# EAGLE design psu_board (EAGLE 9.3.0)
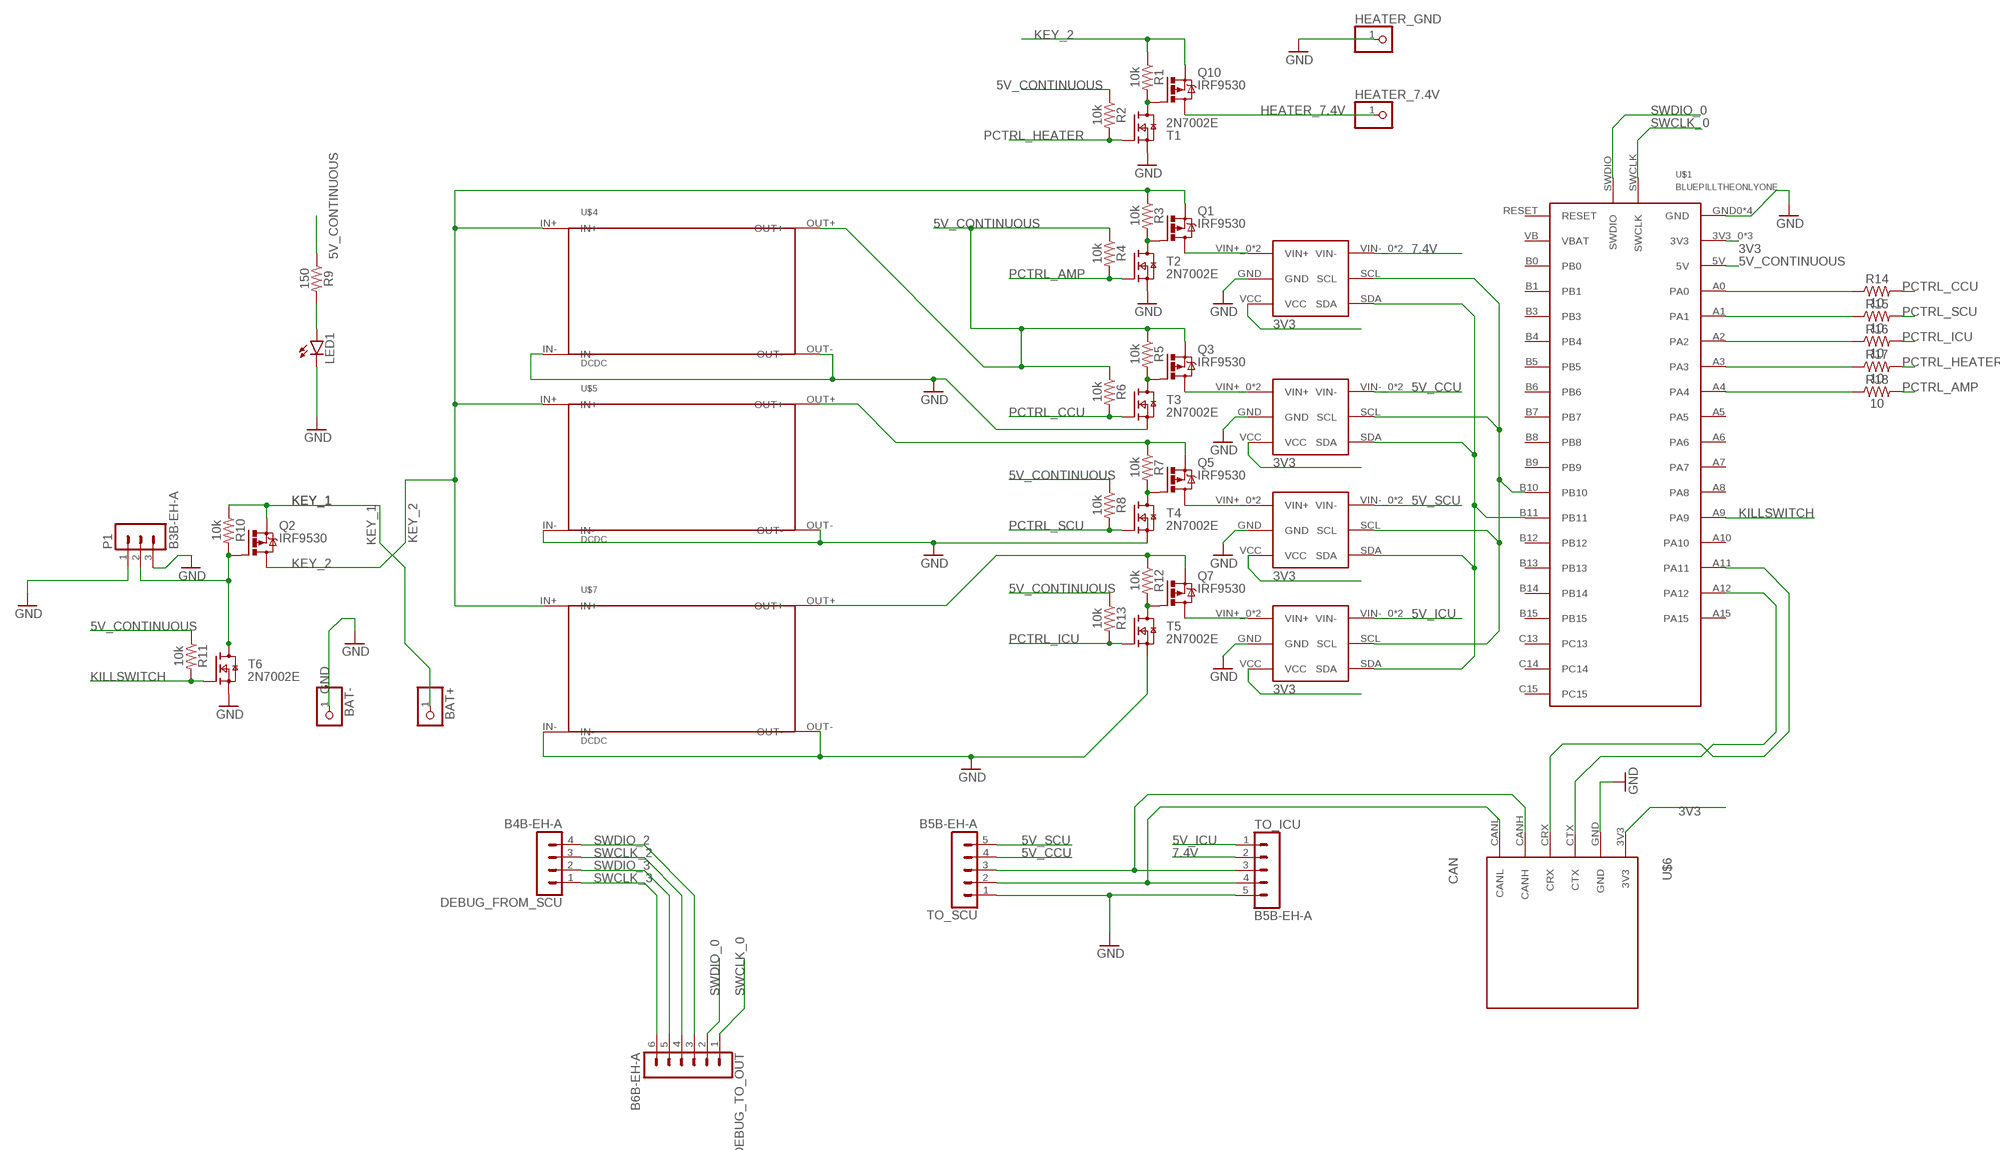
[diagram p0: schematic, sheet 1]

## Parts
BAT+  PINHD-1X1  [1X01]
BAT-  PINHD-1X1  [1X01]
DEBUG_FROM_SCU  B4B-EH-A  [B4B-EH-A]
DEBUG_TO_OUT  B6B-EH-A  [B6B-EH-A]
HEATER_7.4V  PINHD-1X1  [1X01]
HEATER_GND  PINHD-1X1  [1X01]
LED1  LED5MM  [LED5MM]
P1  B3B-EH-A  [B3B-EH-A]
Q1  IRF9530  [TO220BV]
Q2  IRF9530  [TO220BV]
Q3  IRF9530  [TO220BV]
Q5  IRF9530  [TO220BV]
Q7  IRF9530  [TO220BV]
Q10  IRF9530  [TO220BV]
R1  10k  RESISTORAXIAL-0.3  [AXIAL-0.3]
R2  10k  RESISTORAXIAL-0.3  [AXIAL-0.3]
R3  10k  RESISTORAXIAL-0.3  [AXIAL-0.3]
R4  10k  RESISTORAXIAL-0.3  [AXIAL-0.3]
R5  10k  RESISTORAXIAL-0.3  [AXIAL-0.3]
R6  10k  RESISTORAXIAL-0.3  [AXIAL-0.3]
R7  10k  RESISTORAXIAL-0.3  [AXIAL-0.3]
R8  10k  RESISTORAXIAL-0.3  [AXIAL-0.3]
R9  150  RESISTORAXIAL-0.3  [AXIAL-0.3]
R10  10k  RESISTORAXIAL-0.3  [AXIAL-0.3]
R11  10k  RESISTORAXIAL-0.3  [AXIAL-0.3]
R12  10k  RESISTORAXIAL-0.3  [AXIAL-0.3]
R13  10k  RESISTORAXIAL-0.3  [AXIAL-0.3]
R14  10  RESISTORAXIAL-0.3  [AXIAL-0.3]
R15  10  RESISTORAXIAL-0.3  [AXIAL-0.3]
R16  10  RESISTORAXIAL-0.3  [AXIAL-0.3]
R17  10  RESISTORAXIAL-0.3  [AXIAL-0.3]
R18  10  RESISTORAXIAL-0.3  [AXIAL-0.3]
T1  2N7002E  [SOT23]
T2  2N7002E  [SOT23]
T3  2N7002E  [SOT23]
T4  2N7002E  [SOT23]
T5  2N7002E  [SOT23]
T6  2N7002E  [SOT23]
TO_ICU  B5B-EH-A  [B5B-EH-A]
TO_SCU  B5B-EH-A  [B5B-EH-A]
U$1  BLUEPILLTHEONLYONE  [BLUEPIL]
U$2  INA  [INA]
U$3  INA  [INA]
U$4  DCDC  [DCDC]
U$5  DCDC  [DCDC]
U$6  CAN  [CAN]
U$7  DCDC  [DCDC]
U$8  INA  [INA]
U$9  INA  [INA]

## Nets
3V3: U$1.3V3_0(3V3) U$1.3V3_1(3V3) U$1.3V3_2(3V3) U$2.VCC U$3.VCC U$6.3V3 U$8.VCC U$9.VCC
5V_CCU: TO_SCU.4 U$9.VIN-_0(VIN-) U$9.VIN-_1(VIN-)
5V_CONTINUOUS: Q3.S R2.P$1 R4.P$1 R5.P$1 R6.P$1 R8.P$1 R9.P$1 R11.P$1 R13.P$1 U$1.5V U$4.OUT+
5V_ICU: TO_ICU.1 U$2.VIN-_0(VIN-) U$2.VIN-_1(VIN-)
5V_SCU: TO_SCU.5 U$8.VIN-_0(VIN-) U$8.VIN-_1(VIN-)
7.4V: TO_ICU.2 U$3.VIN-_0(VIN-) U$3.VIN-_1(VIN-)
CANH: TO_ICU.3 TO_SCU.3 U$6.CANH
CANL: TO_ICU.4 TO_SCU.2 U$6.CANL
GND: BAT-.1 HEATER_GND.1 LED1.K(C) P1.1 P1.3 T1.2(S) T2.2(S) T3.2(S) T4.2(S) T5.2(S) T6.2(S) TO_ICU.5 TO_SCU.1 U$1.GND0(GND) U$1.GND1(GND) U$1.GND2(GND) U$1.GND3(GND) U$2.GND U$3.GND U$4.IN- U$4.OUT- U$5.IN- U$5.OUT- U$6.GND U$7.IN- U$7.OUT- U$8.GND U$9.GND
HEATER_7.4V: HEATER_7.4V.1 Q10.D
KEY_1: BAT+.1 Q2.S R10.P$1
KEY_2: Q1.S Q2.D Q10.S R1.P$1 R3.P$1 U$4.IN+ U$5.IN+ U$7.IN+
KILLSWITCH: R11.P$2 T6.1(G) U$1.A9
N$1: Q1.G R3.P$2 T2.3(D)
N$2: U$1.A11 U$6.CRX
N$3: Q5.G R7.P$2 T4.3(D)
N$4: Q7.G R12.P$2 T5.3(D)
N$5: Q5.S R7.P$1 U$5.OUT+
N$6: Q3.G R5.P$2 T3.3(D)
N$7: Q7.S R12.P$1 U$7.OUT+
N$8: Q1.D U$3.VIN+_0(VIN+) U$3.VIN+_1(VIN+)
N$9: Q3.D U$9.VIN+_0(VIN+) U$9.VIN+_1(VIN+)
N$10: Q5.D U$8.VIN+_0(VIN+) U$8.VIN+_1(VIN+)
N$11: Q7.D U$2.VIN+_0(VIN+) U$2.VIN+_1(VIN+)
N$12: U$1.B11 U$2.SDA U$3.SDA U$8.SDA U$9.SDA
N$13: U$1.B10 U$2.SCL U$3.SCL U$8.SCL U$9.SCL
N$14: U$1.A12 U$6.CTX
N$15: LED1.A R9.P$2
N$16: Q10.G R1.P$2 T1.3(D)
N$17: R14.P$1 U$1.A0
N$18: R15.P$1 U$1.A1
N$19: R16.P$1 U$1.A2
N$20: R17.P$1 U$1.A3
N$21: R18.P$1 U$1.A4
N$22: P1.2 Q2.G R10.P$2 T6.3(D)
PCTRL_AMP: R4.P$2 R18.P$2 T2.1(G)
PCTRL_CCU: R6.P$2 R14.P$2 T3.1(G)
PCTRL_HEATER: R2.P$2 R17.P$2 T1.1(G)
PCTRL_ICU: R13.P$2 R16.P$2 T5.1(G)
PCTRL_SCU: R8.P$2 R15.P$2 T4.1(G)
SWCLK_0: DEBUG_TO_OUT.1 U$1.SWCLK
SWCLK_2: DEBUG_FROM_SCU.3 DEBUG_TO_OUT.4
SWCLK_3: DEBUG_FROM_SCU.1 DEBUG_TO_OUT.6
SWDIO_0: DEBUG_TO_OUT.2 U$1.SWDIO
SWDIO_2: DEBUG_FROM_SCU.4 DEBUG_TO_OUT.3
SWDIO_3: DEBUG_FROM_SCU.2 DEBUG_TO_OUT.5
Unconnected: U$1.A5 U$1.A6 U$1.A7 U$1.A8 U$1.A10 U$1.A15 U$1.B0 U$1.B1 U$1.B3 U$1.B4 U$1.B5 U$1.B6 U$1.B7 U$1.B8 U$1.B9 U$1.B12 U$1.B13 U$1.B14 U$1.B15 U$1.C13 U$1.C14 U$1.C15 U$1.RESET U$1.VB(VBAT)

## Library data of the parts
BAT+ BAT- HEATER_7.4V HEATER_GND = pinhead:PINHD-1X1: PIN HEADER
DEBUG_FROM_SCU = con-jst-eh:B4B-EH-A: HEADER
DEBUG_TO_OUT = con-jst-eh:B6B-EH-A: HEADER
LED1 = led:LED: LED OSRAM: - CHIPLED LG R971, LG N971, LY N971, LG Q971, LY Q971, LO R971, LY R971 LH N974, LH R974 LS Q976, LO Q976, LY Q976 LO Q996 - Hyper CHIPLED LW Q18S LB Q993, LB Q99A, LB R99A - SideLED LS A670, LO A670, LY A670, LG A670, LP A670 LB A673, LV A673, LT A673, LW A673 LH A674 LY A675 LS A676, LA A676, LO A676, LY A676, LW A676 LS A679, LY A679, LG A679 - Hyper Micro SIDELED® LS Y876, LA Y876, LO Y876, LY Y876 LT Y87S - SmartLED LW L88C, LW L88S LB L89C, LB L89S, LG L890 LS L89K, LO L89K, LY L89K LS L896, LA L896, LO L896, LY L896 - TOPLED LS T670, LO T670, LY T670, LG T670, LP T670 LSG T670, LSP T670, LSY T670, LOP T670, LYG T670 LG T671, LOG T671, LSG T671 LB T673, LV T673, LT T673, LW T673 LH T674 LS T676, LA T676, LO T676, LY T676, LB T676, LH T676, LSB T676, LW T676 LB T67C, LV T67C, LT T67C, LS T67K, LO T67K, LY T67K, LW E67C LS E67B, LA E67B, LO E67B, LY E67B, LB E67C, LV E67C, LT E67C LW T67C LS T679, LY T679, LG T679 LS T770, LO T770, LY T770, LG T770, LP T770 LB T773, LV T773, LT T773, LW T773 LH T774 LS E675, LA E675, LY E675, LS T675 LS T776, LA T776, LO T776, LY T776, LB T776 LHGB T686 LT T68C, LB T68C - Hyper Mini TOPLED® LB M676 - Mini TOPLED Santana® LG M470 LS M47K, LO M47K, LY M47K Source: http://www.osram.convergy.de LUXEON: - LUMILED® LXK2-PW12-R00, LXK2-PW12-S00, LXK2-PW14-U00, LXK2-PW14-V00 LXK2-PM12-R00, LXK2-PM12-S00, LXK2-PM14-U00 LXK2-PE12-Q00, LXK2-PE12-R00, LXK2-PE12-S00, LXK2-PE14-T00, LXK2-PE14-U00 LXK2-PB12-K00, LXK2-PB12-L00, LXK2-PB12-M00, LXK2-PB14-N00, LXK2-PB14-P00, LXK2-PB14-Q00 LXK2-PR12-L00, LXK2-PR12-M00, LXK2-PR14-Q00, LXK2-PR14-R00 LXK2-PD12-Q00, LXK2-PD12-R00, LXK2-PD12-S00 LXK2-PH12-R00, LXK2-PH12-S00 LXK2-PL12-P00, LXK2-PL12-Q00, LXK2-PL12-R00 Source: www.luxeon.com KINGBRIGHT: KA-3528ASYC Source: www.kingbright.com
P1 = con-jst-eh:B3B-EH-A: HEADER
Q1-Q3 Q5 Q7 Q10 = transistor-power:IRF9530: P-CHANNEL HEXFET POWER-MOS-FET Source: http://www.irf.com/product-info/datasheets/data/irf9530.pdf
R1-R18 = SparkFun-Resistors:RESISTOR: Generic Resistor Package
T1-T6 = nxp_60:2N7002: N-channel TrenchMOS FET N-channel enhancement mode Field-Effect Transistor (FET) in a plastic package using TrenchMOS technology. AAL Eindhoven MK
TO_ICU TO_SCU = con-jst-eh:B5B-EH-A: HEADER
U$1 = bluepill:BLUEPILL: BLUEPILL
U$2 U$3 U$8 U$9 = bluepill:INA
U$4 U$5 U$7 = bluepill:DCDC: DCDC
U$6 = bluepill:CAN

## Board
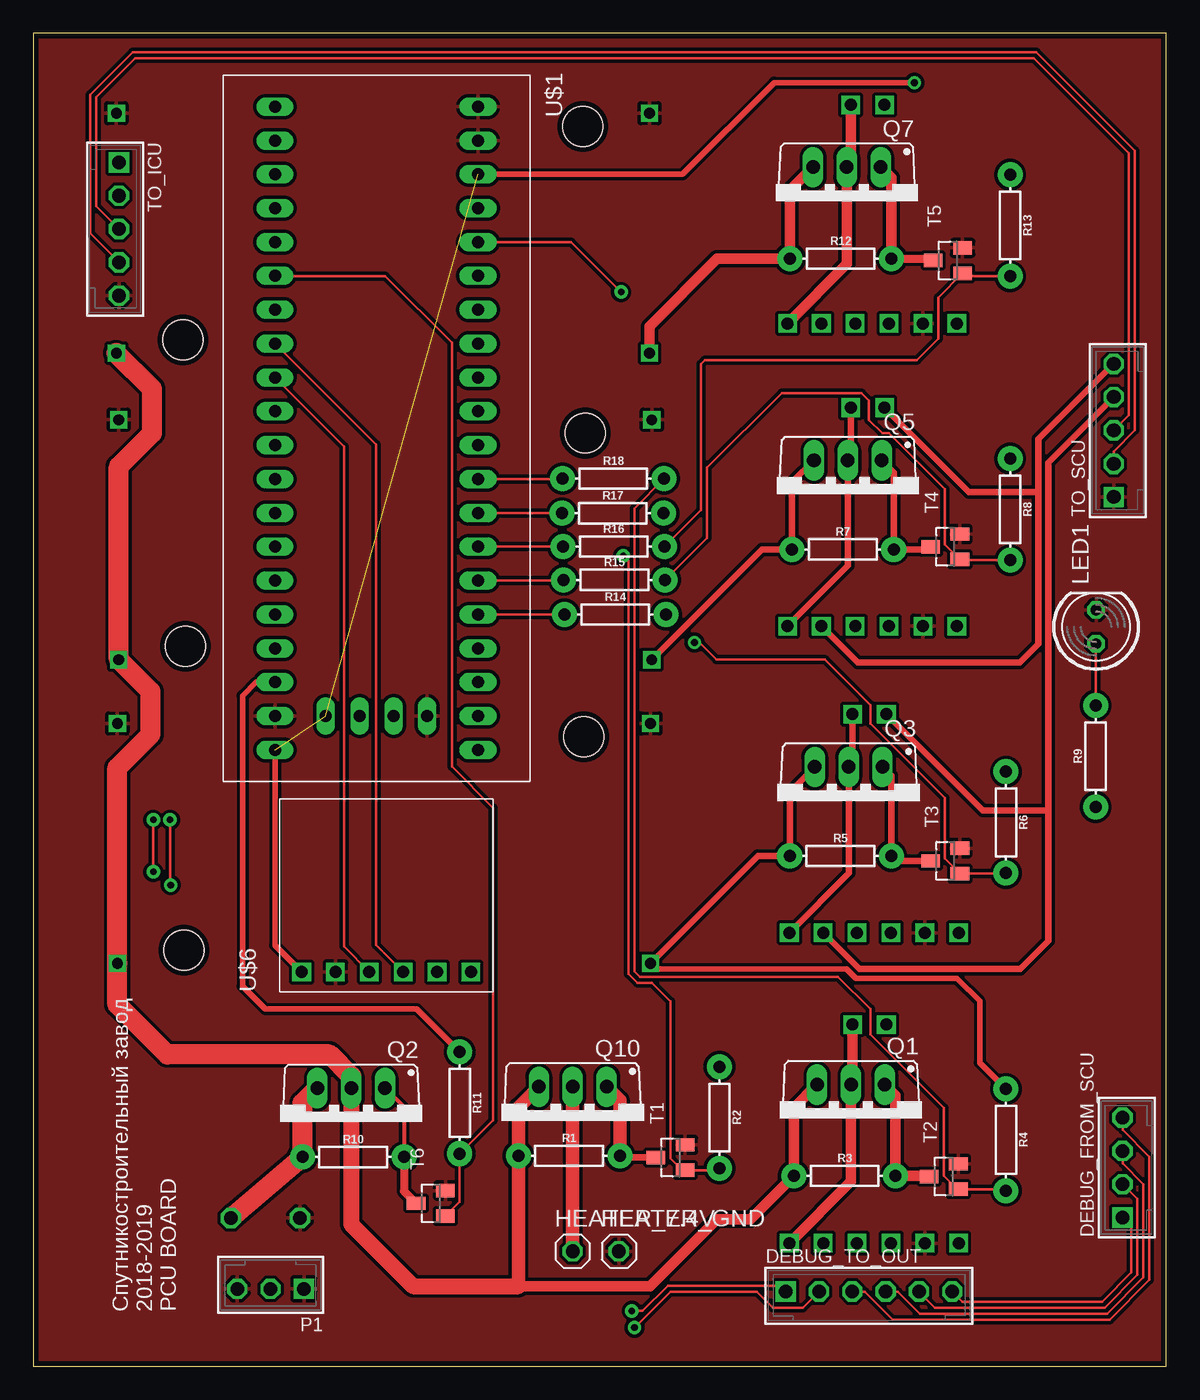
[diagram p1: board, top side]
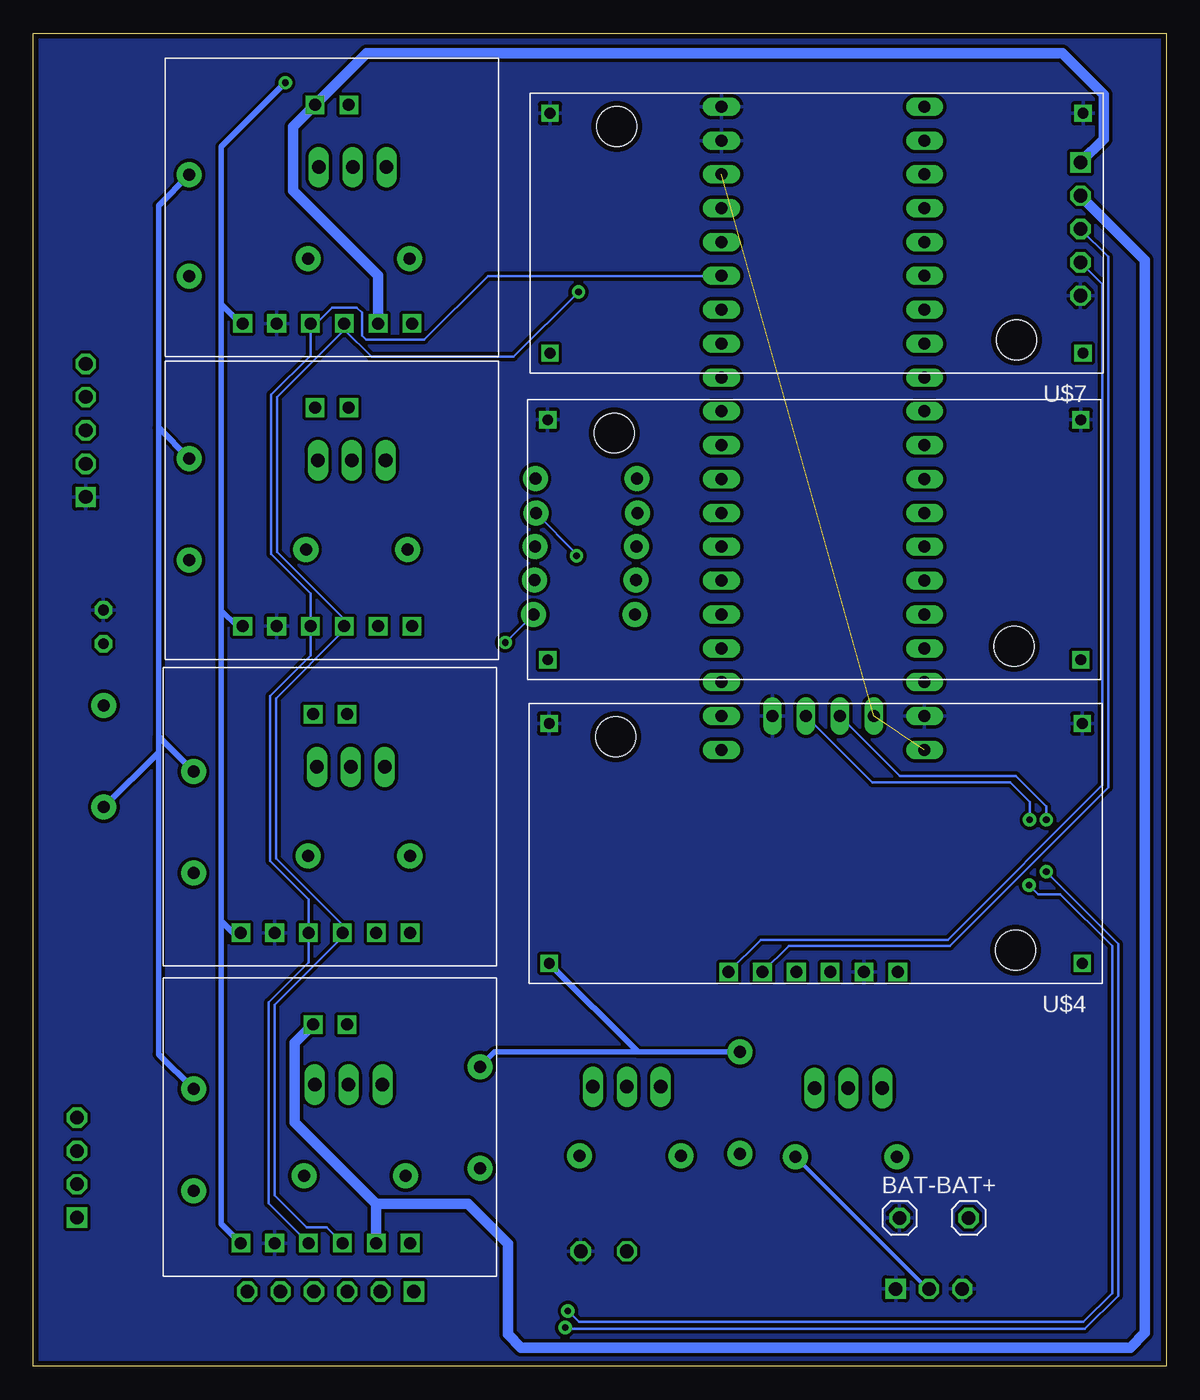
[diagram p2: board, bottom side, seen from below]

Size 85 x 100 mm. Coordinates in mm from the lower left corner, seen from the top.
Outline: 0,0 85,0 85,100 0,100 0,0
Copper layers (1*16): Top 0.035mm / dielectric 1mm / Bottom 0.035mm
Design rules "rezonit": minimum track width 0.2mm, minimum drill 0.5mm, track to track 0.25mm, track to pad 0.25mm, pad to pad 0.25mm, via to via 0.25mm, smd to smd 0.2mm, copper to edge 0.4mm, drill to drill 0.4mm, minimum pad ring 0.25mm, minimum via ring 0.25mm, stop-mask expansion 4mil, vias tented up to drill 0.6mm, thermal gap 10mil

### Footprints (pad centres in the part's own frame; a part is rotated, then mirrored left to right if it is on the bottom)
1X01 = drill 1.016 octagon: 1 0,0
B4B-EH-A = drill 1.016 square: 1 -3.75,0 | drill 1.016 octagon: 2 -1.25,0; 3 1.25,0; 4 3.75,0
B6B-EH-A = drill 1.016 square: 1 -6.25,0 | drill 1.016 octagon: 2 -3.75,0; 3 -1.25,0; 4 1.25,0; 5 3.75,0; 6 6.25,0
LED5MM = drill 0.813 octagon: A -1.27,0; K 1.27,0
B3B-EH-A = drill 1.016 square: 1 -2.5,0 | drill 1.016 octagon: 2 0,0; 3 2.5,0
TO220BV = drill 1.016 long: D 0,-2.54; G -2.54,-2.54; S 2.54,-2.54
AXIAL-0.3 = drill 0.9 pad 1.88: P$1 -3.81,0; P$2 3.81,0
SOT23 = smd 1 x 1.4: 1 -0.95,-1.1; 2 0.95,-1.1; 3 0,1.1
B5B-EH-A = drill 1.016 square: 1 -5,0 | drill 1.016 octagon: 2 -2.5,0; 3 0,0; 4 2.5,0; 5 5,0
BLUEPIL = drill 0.9 long: 3V3_0 -19.05,7.62; 3V3_1 24.13,-7.62; 3V3_2 21.59,-3.81; 5V 19.05,-7.62; A0 13.97,7.62; A1 11.43,7.62; A2 8.89,7.62; A3 6.35,7.62; A4 3.81,7.62; A5 1.27,7.62; A6 -1.27,7.62; A7 -3.81,7.62; A8 -13.97,-7.62; A9 -11.43,-7.62; A10 -8.89,-7.62; A11 -6.35,-7.62; A12 -3.81,-7.62; A15 -1.27,-7.62; B0 -6.35,7.62; B1 -8.89,7.62; B3 1.27,-7.62; B4 3.81,-7.62; B5 6.35,-7.62; B6 8.89,-7.62; B7 11.43,-7.62; B8 13.97,-7.62; B9 16.51,-7.62; B10 -11.43,7.62; B11 -13.97,7.62; B12 -24.13,-7.62; B13 -21.59,-7.62; B14 -19.05,-7.62; B15 -16.51,-7.62; C13 21.59,7.62; C14 19.05,7.62; C15 16.51,7.62; GND0 -24.13,7.62; GND1 -21.59,7.62; GND2 21.59,-7.62; GND3 21.59,3.81; RESET -16.51,7.62; SWCLK 21.59,1.27; SWDIO 21.59,-1.27; VB 24.13,7.62
INA = drill 0.9 square: GND -4.15,-8.7; SCL -1.61,-8.7; SDA 0.93,-8.7; VCC -6.69,-8.7; VIN+_0 6.01,-8.7; VIN+_1 1.27,7.7; VIN-_0 3.47,-8.7; VIN-_1 -1.27,7.7
DCDC = drill 0.8 square: IN+ -20,9; IN- -20,-9; OUT+ 20,9; OUT- 20,-9 | hole 3: -15,8; 15,-8
CAN = drill 0.9 square: 3V3 -5.75,6.35; CANH -5.75,-3.81; CANL -5.75,-6.35; CRX -5.75,-1.27; CTX -5.75,1.27; GND -5.75,3.81

### Placement (x,y rotation side)
BAT+  14.83,11.12 0 bottom
BAT-  20.01,11.12 0 bottom
DEBUG_FROM_SCU  81.73,14.9 90 top
DEBUG_TO_OUT  62.7,5.6 0 top
HEATER_7.4V  40.46,8.62 0 top
HEATER_GND  43.93,8.62 0 top
LED1  79.74,55.47 90 top
P1  17.8,5.8 180 top
Q1  61.35,18.59 180 top
Q2  23.85,18.32 180 top
Q3  61.18,42.42 180 top
Q5  61.11,65.42 180 top
Q7  61.04,87.42 180 top
Q10  40.47,18.42 180 top
R1  40.2,15.78 0 top
R2  51.48,18.66 270 top
R3  60.88,14.28 0 top
R4  72.98,16.98 270 top
R5  60.56,38.28 0 top
R6  72.98,40.8 270 top
R7  60.74,61.28 0 top
R8  73.29,64.28 270 top
R9  79.71,45.76 90 top
R10  24,15.69 0 top
R11  31.99,19.76 270 top
R12  60.58,83.09 0 top
R13  73.29,85.58 270 top
R14  43.66,56.39 0 top
R15  43.6,58.99 0 top
R16  43.54,61.49 0 top
R17  43.48,63.99 0 top
R18  43.52,66.59 0 top
T1  47.81,15.66 90 top
T2  68.31,14.23 90 top
T3  68.42,37.91 90 top
T4  68.42,61.48 90 top
T5  68.62,82.95 90 top
T6  29.82,12.22 90 top
TO_ICU  6.43,85.32 270 top
TO_SCU  81.07,70.21 90 top
U$1  25.75,70.37 270 top
U$2  62.6,86.93 0 bottom
U$3  62.74,17.93 0 bottom
U$4  26.3,39.22 180 bottom
U$5  26.41,62.01 180 bottom
U$6  26.48,35.32 90 top
U$7  26.23,85.01 180 bottom
U$8  62.6,64.22 0 bottom
U$9  62.74,41.22 0 bottom

### Tracks (layer width: path | path; a pad name or v marks a point on that pad's centre or on a via)
3V3  (via drill 0.5)  (2 unrouted)
  Top 0.4: U$1.3V3_0 48.72,89.42 55.6,96.3 v66.1,96.3 | U$1.3V3_1 18.13,31.57 U$6.3V3
  Bottom 0.4: v66.1,96.3 70.9,91.5 70.9,79.7 | U$3.VCC 70.9,10.67 70.9,33.4 | 70.9,79.7 70.9,56.7 | 70.9,56.7 70.9,33.4 | U$9.VCC 70.02,32.52 70.9,33.4 | U$8.VCC 69.72,55.52 70.9,56.7 | U$2.VCC 69.43,78.23 70.9,79.7
5V_CCU
  Top 0.5: U$9.VIN-_0 61.99,29.8 74.06,29.8 76.15,31.89 76.15,41.7 | TO_SCU.4 76.15,67.79 76.15,41.7 | U$9.VIN-_1 71.23,41.7 76.15,41.7
5V_CONTINUOUS
  Top 0.4: U$1.5V 16.72,51.32 15.7,50.3 15.7,28.5 17.4,26.8 28.76,26.8 R11.P$1 | U$4.OUT+ 46.72,29.8 61,29.8 61.7,29.1 69.3,29.1 71,27.4 71,22.77 R4.P$1
  Top 0.5: Q3.S 56.75,43.07 R5.P$1 54.36,38.28 U$4.OUT+
  Bottom 0.4: U$4.OUT+ 39.65,23.57 | 39.65,23.57 R11.P$1 | 39.65,23.57 50.38,23.57 R2.P$1 | R13.P$1 75.6,87.08 75.6,70.4 | R4.P$1 75.6,23.41 75.6,46.06 | 75.6,70.4 75.6,47.23 | R6.P$1 75.6,47.23 | R9.P$1 75.6,46.06 | 75.6,46.06 75.6,47.23 | R8.P$1 75.6,70.4
5V_ICU
  Bottom 0.8: U$2.VIN-_0 59.13,81.83 65.5,88.2 65.5,93 U$2.VIN-_1 60,98.5 7.8,98.5 4.7,95.4 4.7,92.05 TO_ICU.1
5V_SCU
  Top 0.5: U$8.VIN-_0 61.85,52.8 74,52.8 75.4,54.2 75.4,65.6 | TO_SCU.5 75.4,69.54 75.4,65.6 | U$8.VIN-_1 70.19,65.6 75.4,65.6
7.4V
  Bottom 0.8: U$3.VIN-_1 65.4,24.24 65.4,18.3 59.27,12.17 | 59.27,12.17 U$3.VIN-_0 | 59.27,12.17 52.37,12.17 49.4,9.2 49.4,2.4 48.4,1.4 2.7,1.4 1.6,2.5 1.6,82.99 TO_ICU.2
CANH
  Top 0.2: TO_ICU.3 4.7,87.05 4.7,95.2 7.63,98.13 75.07,98.13 82.2,91 82.2,71.34 TO_SCU.3
  Bottom 0.2: TO_ICU.3 4.35,83.24 4.35,43.41 16.21,31.55 28.31,31.55 U$6.CANH
CANL
  Top 0.2: TO_ICU.4 4.25,85 4.25,95.39 7.44,98.58 75.26,98.58 82.65,91.19 82.65,70.22 81.07,68.64 TO_SCU.2
  Bottom 0.2: TO_ICU.4 4.8,81.19 4.8,43.6 16.4,32 30.4,32 U$6.CANL
GND
  pour Top: 0,100 85,100 85,0 0,0
  pour Bottom: 0,100 85,100 85,0 0,0
HEATER_7.4V
  Top 1: Q10.D HEATER_7.4V.1
KEY_1
  Top 1.5: Q2.S 20.19,19.74 R10.P$1 BAT+.1
KEY_2
  Top 0.8: Q1.S 57.07,19.39 R3.P$1 53.82,11.03 51.29,11.03 46.26,6 36.4,6
  Top 1: Q10.S 36.39,19.42 R1.P$1 36.4,6
  Top 1.2: Q2.D 23.85,10.65 28.5,6 36.4,6
  Top 1.5: Q2.D 23.85,21.75 22.22,23.38 10.06,23.38 6.3,27.14 U$4.IN+ 6.3,44.9 8.8,47.4 8.8,50.62 U$5.IN+ 6.41,67.51 8.9,70 8.9,73.34 U$7.IN+
KILLSWITCH
  Top 0.2: T6.1 31.99,12.34 R11.P$2 34.5,18.46 34.5,41.9 31.4,45 31.4,76.8 26.4,81.8 U$1.A9
N$1
  Top 0.8: Q1.G 64.69,20.33 R3.P$2 67.16,14.28 T2.3
N$2
  Top 0.2: U$1.A11 25.7,69.15 25.7,31.62 U$6.CRX
N$3
  Top 0.5: Q5.G 64.55,67.06 R7.P$2 67.12,61.28 T4.3
N$4
  Top 0.6: R12.P$2 67.38,83.09 T5.3
  Top 0.8: Q7.G 64.39,89.15 R12.P$2
N$5
  Top 0.5: Q5.S 56.93,66.32 R7.P$1 54.68,61.28 U$5.OUT+
N$6
  Top 0.5: Q3.G 64.37,44.31 R5.P$2 64.74,37.91 T3.3
N$7
  Top 0.8: Q7.S 56.77,88.23 R12.P$1 51.31,83.09 46.23,78.01 U$7.OUT+
N$8
  Top 0.8: U$3.VIN+_1 61.47,21.25 Q1.D 61.35,13.88 U$3.VIN+_0
N$9
  Top 0.5: U$9.VIN+_1 61.47,45.25 Q3.D 61.18,37 U$9.VIN+_0
N$10
  Top 0.5: U$8.VIN+_1 61.33,68.18 Q5.D 61.11,60.07 U$8.VIN+_0
N$11
  Top 0.8: U$2.VIN+_1 61.33,90.25 Q7.D 61.04,82.71 U$2.VIN+_0
N$12  (via drill 0.5)
  Top 0.2: v44.1,80.6 40.36,84.34 U$1.B11
  Bottom 0.2: U$3.SDA 63.01,10.43 64.5,10.43 66.9,12.83 66.9,27.1 61.81,32.19 U$9.SDA 61.81,33.09 61.8,33.1 66.8,38.1 66.8,50.1 61.67,55.23 U$8.SDA 61.67,56.07 66.7,61.1 66.7,72.7 61.67,77.73 U$2.SDA 61.67,77.77 59.63,75.73 48.97,75.73 v44.1,80.6
N$13
  Bottom 0.2: U$3.SCL 67.35,12.23 67.35,27.29 64.35,30.29 U$9.SCL 64.35,35.01 67.25,37.91 67.25,50.29 64.21,53.33 U$8.SCL 64.21,57.97 67.15,60.91 67.15,72.89 64.21,75.83 U$2.SCL 63.77,78.23 62.56,79.43 60.73,79.43 60.33,79.03 60.33,77.33 60.02,77.03 55.67,77.03 50.9,81.8 U$1.B10
N$14
  Top 0.2: U$1.A12 23.3,69.01 23.3,31.48 U$6.CTX
N$15
  Top 0.2: R9.P$2 79.71,54.17 LED1.A
N$16
  Top 0.5: R1.P$2 44.13,15.66 T1.3
  Top 1: Q10.G 44.01,19.96 R1.P$2
N$17
  Top 0.2: U$1.A0 R14.P$1
N$18
  Top 0.2: U$1.A1 39.74,58.94 R15.P$1
N$19
  Top 0.2: U$1.A2 R16.P$1
N$20
  Top 0.2: U$1.A3 39.64,64.02 R17.P$1
N$21
  Top 0.2: U$1.A4 39.68,66.56 R18.P$1
N$22
  Top 0.3: Q2.G 27.81,19.44 R10.P$2
  Top 0.6: R10.P$2 27.81,13.13 T6.3
  Bottom 0.3: R10.P$2 17.92,5.8 P1.2
PCTRL_AMP
  Top 0.2: R4.P$2 72.87,13.28 T2.1 69.32,13.28 68.3,14.3 68.3,19.4 62.8,24.9 62.8,26.8 60.38,29.22 45.51,29.22 45.1,29.62 45.1,64.36 R18.P$2
PCTRL_CCU  (via drill 0.5)
  Top 0.2: R6.P$2 72.95,36.96 T3.1 68.4,38.08 68.4,42.63 62.81,48.23 62.81,49.59 59.38,53.02 51.27,53.02 49.99,54.3 v49.6,54.3
  Bottom 0.2: R14.P$2 49.56,54.3 v49.6,54.3
PCTRL_HEATER  (via drill 0.5)
  Top 0.2: R2.P$2 51.34,14.71 T1.1 48.69,14.71 47.8,15.6 47.8,27.37 46.4,28.77 45.32,28.77 44.65,29.44 44.65,60.4 v44.25,60.8
  Bottom 0.2: R17.P$2 44.25,60.95 v44.25,60.8
PCTRL_ICU
  Top 0.2: R13.P$2 69.95,81.77 T5.1 67.9,80.18 67.9,77.1 66.3,75.5 50.4,75.5 50.1,75.2 50.1,64.24 R16.P$2
PCTRL_SCU
  Top 0.2: R8.P$2 69.58,60.47 T4.1 68.4,61.65 68.4,65.8 64.2,70 63.7,70 62.7,71 62.7,72.44 62.12,73.02 56.17,73.02 50.55,67.4 50.55,62.13 R15.P$2
SWCLK_0  (via drill 0.5)
  Top 0.2: v10.25,41 10.25,36.15 v10.3,36.1 | v44.9,4.15 45.71,4.15 47.61,6.05 56,6.05 DEBUG_TO_OUT.1
  Bottom 0.2: U$1.SWCLK 22.04,43.8 11.7,43.8 10.25,42.35 v10.25,41 | v10.3,36.1 9.6,35.4 7.94,35.4 4.05,31.51 4.05,5.49 6.22,3.32 44.07,3.32 v44.9,4.15
SWCLK_2
  Top 0.2: DEBUG_TO_OUT.4 64.88,5.6 66.53,3.95 80.59,3.95 83.29,6.66 83.29,13.66 81.73,15.22 DEBUG_FROM_SCU.3
SWCLK_3
  Top 0.2: DEBUG_TO_OUT.6 69.7,4.85 80.21,4.85 82.39,7.03 82.39,10.49 DEBUG_FROM_SCU.1
SWDIO_0  (via drill 0.5)
  Top 0.2: v9,41 v9,37.1 | v45.1,2.9 47.8,5.6 54.3,5.6 55.5,4.4 57.75,4.4 DEBUG_TO_OUT.2
  Bottom 0.2: U$1.SWDIO 20,44.3 11.3,44.3 9,42 v9,41 | v9,37.1 3.6,31.7 3.6,5.3 6.1,2.8 45,2.8 v45.1,2.9
SWDIO_2
  Top 0.2: DEBUG_TO_OUT.3 62.38,5.6 64.48,3.5 80.77,3.5 83.74,6.47 83.74,15.71 81.73,17.72 DEBUG_FROM_SCU.4
SWDIO_3
  Top 0.2: DEBUG_TO_OUT.5 67.65,4.4 80.4,4.4 82.84,6.84 82.84,12.54 DEBUG_FROM_SCU.2

### Text on the board
tPlace: Спутникостроительный завод / 2018-2019 / PCU BOARD